# Altium schematic sheet CAN_Breakout.SchDoc
size Letter; Organization: Altium Limited; Address1: L3, 12a Rodborough Rd; Address2: Frenchs Forest; Address3: NSW; Address4: Australia 2086
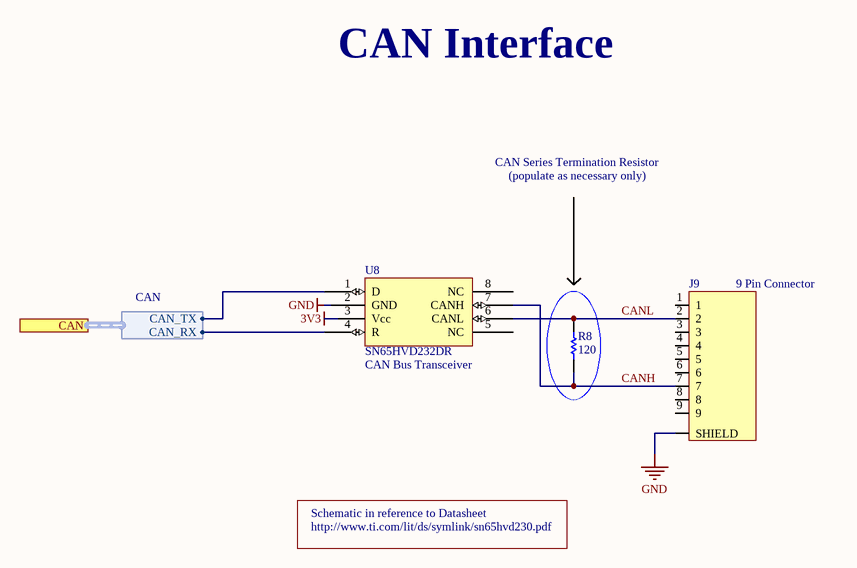
[diagram p0: CAN_Breakout.SchDoc]

## Parts
J9  9 Pin Connector  [9-Pos D-Sub]
R8  value 120  [0402]  (hidden comment: Res1)
U8  CAN Bus Transceiver  [8SOIC-CAN-TRANSCEIVER]

## Ports
CAN (harness CAN)

## Harnesses
CAN: CAN_RX, CAN_TX

## Nets
3V3: U8.3(Vcc)
GND: J9.SHIELD U8.2(GND)
CANH: J9.7 R8.1 U8.7(CANH)
CANL: J9.2 R8.2 U8.6(CANL)
NetU8_1: U8.1(D) ; port CAN.CAN_TX
NetU8_4: U8.4(R) ; port CAN.CAN_RX

Not connected (* = marked no-connect by the designer): J9 1 3 4 5 6 8 9; U8 5(NC) 8(NC)

## Notes on the sheet
- CAN Interface
- CAN Series Termination Resistor
- (populate as necessary only)
- http://www.ti.com/lit/ds/symlink/sn65hvd230.pdf
- Schematic in reference to Datasheet
- Title
- Size:
- Date:
- Letter
- Number:
- Time:
- Revision:
- Sheet
- of
- File:

## Library data of the parts
J9 = 9-Position Connector: Unknown parameter: 772-E09-213R011
R8 = Res1: Resistor
U8 = SN65HVD232DR: Manufacturer: Texas Instruments; Max Data Rate: 1Mbps; Supply Voltage: 3V ~ 3.6V; Manufacturer Part Number: SN65HVD232DR; DigiKey Part Number: 296-26344-1-ND; Operating Temperature: -40 ~ 85 C